# EAGLE design micro_schematic (EAGLE 9.4.0)
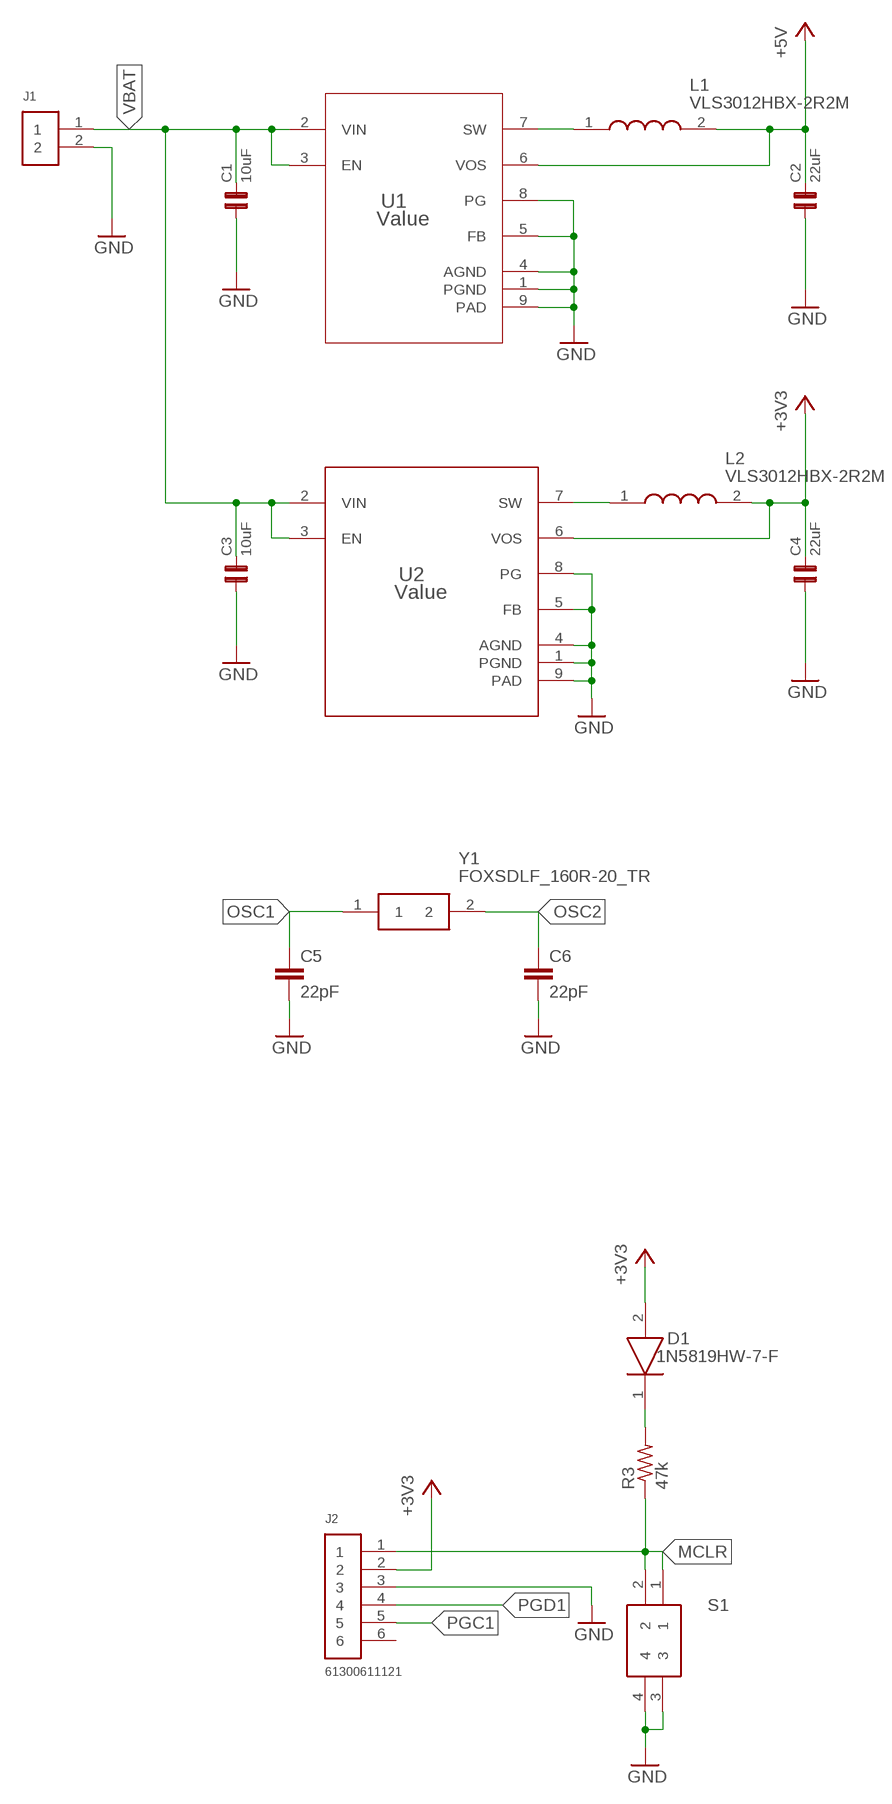
[diagram p0: schematic, sheet 1, part 1 of 2]
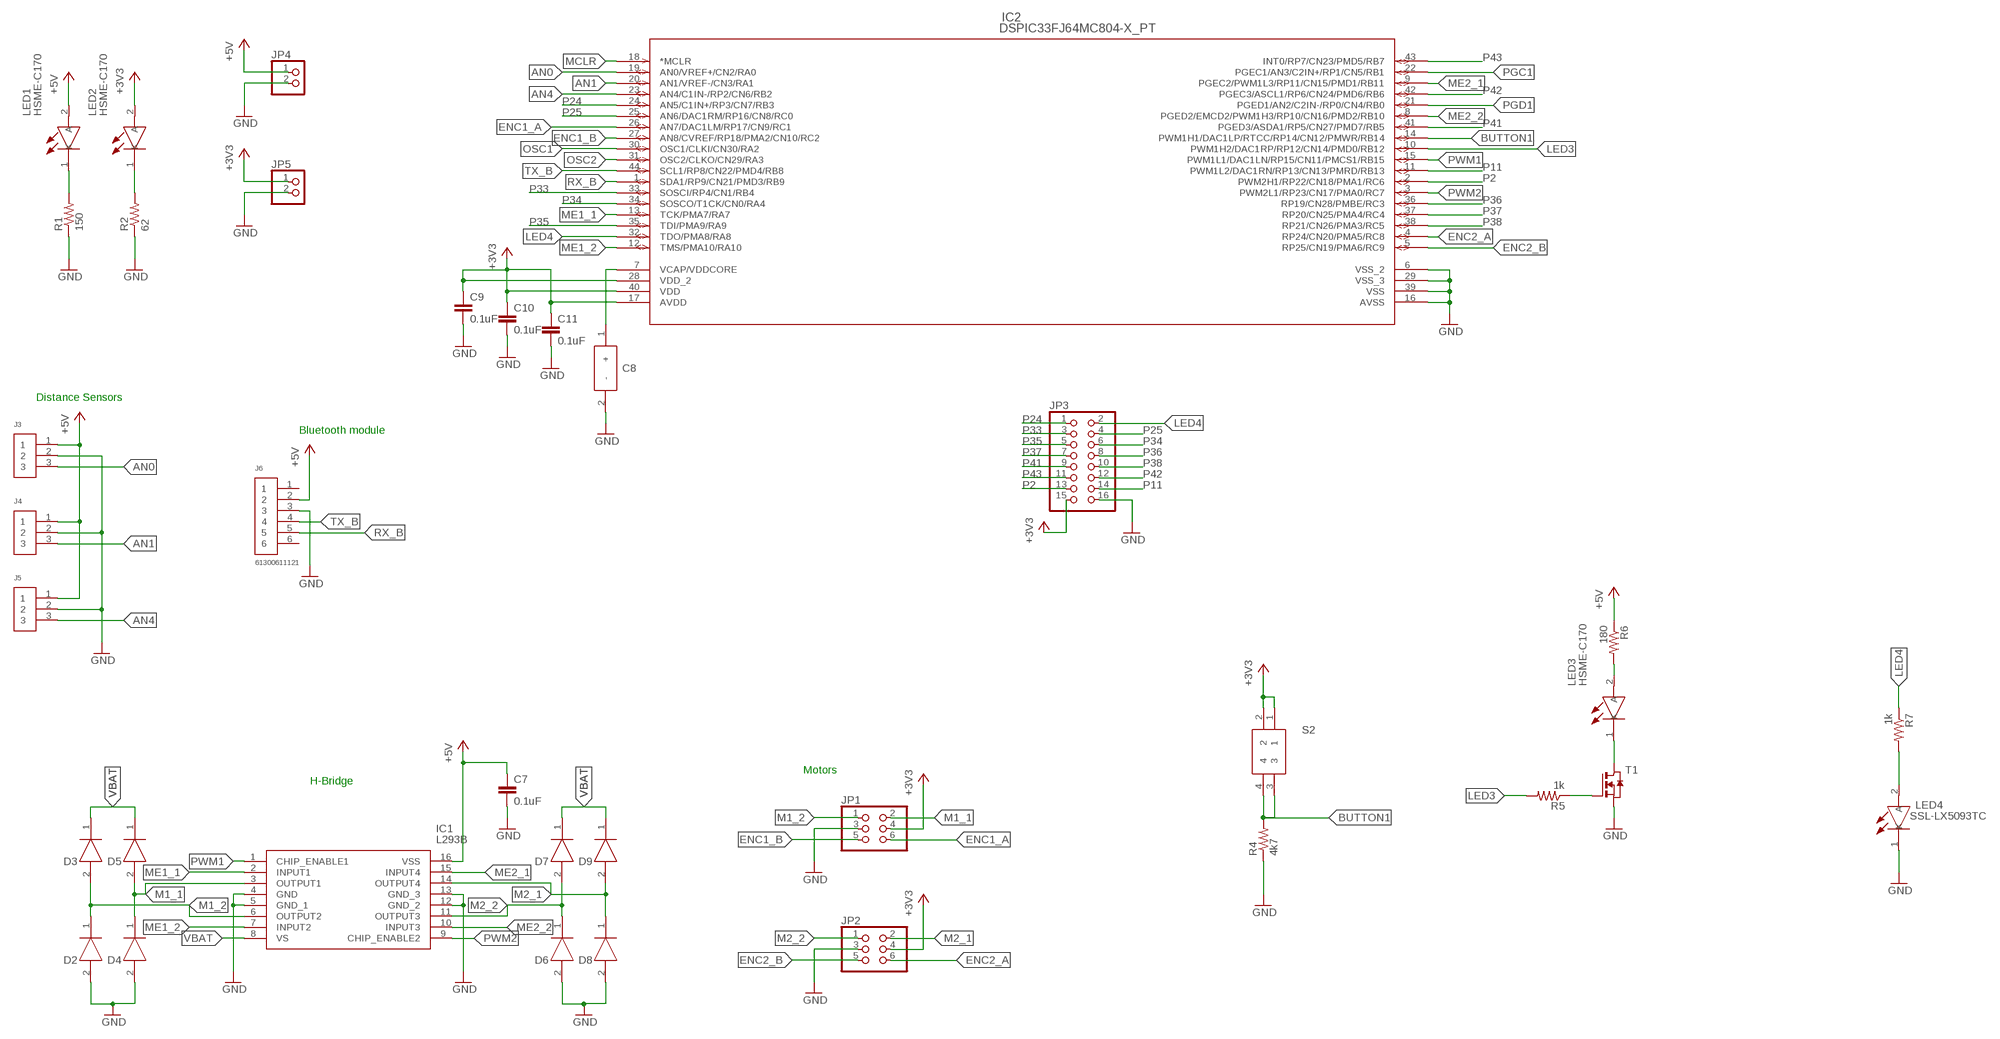
[diagram p1: schematic, sheet 1, part 2 of 2]

## Parts
C1  10uF  C0805  [0805]
C2  22uF  C0805  [0805]
C3  10uF  C0805  [0805]
C4  22uF  C0805  [0805]
C5  22pF  C-EUC0805  [C0805]
C6  22pF  C-EUC0805  [C0805]
C7  0.1uF  C-EUC0805  [C0805]
C8  TPSB106K025T1800  [DIONM3528X210N]
C9  0.1uF  C-EUC0805  [C0805]
C10  0.1uF  C-EUC0805  [C0805]
C11  0.1uF  C-EUC0805  [C0805]
D1  1N5819HW-7-F  [SOD3716X145N]
D2  1N5819HW-7-F  [SOD3716X145N]
D3  1N5819HW-7-F  [SOD3716X145N]
D4  1N5819HW-7-F  [SOD3716X145N]
D5  1N5819HW-7-F  [SOD3716X145N]
D6  1N5819HW-7-F  [SOD3716X145N]
D7  1N5819HW-7-F  [SOD3716X145N]
D8  1N5819HW-7-F  [SOD3716X145N]
D9  1N5819HW-7-F  [SOD3716X145N]
IC1  L293B  [DIP780W50P254L2000H510Q16N]
IC2  DSPIC33FJ64MC804-X_PT  [TQFP44_10X10MC]
J1  61300211121  [61300211121]
J2  61300611121  [61300611121]
J3  61300311121  [61300311121]
J4  61300311121  [61300311121]
J5  61300311121  [61300311121]
J6  61300611121  [61300611121]
JP1  PINHD-2X3  [2X03]
JP2  PINHD-2X3  [2X03]
JP3  PINHD-2X8  [2X08]
JP4  PINHD-1X2  [1X02]
JP5  PINHD-1X2  [1X02]
L1  VLS3012HBX-2R2M  [INDPM3030X120N]
L2  VLS3012HBX-2R2M  [INDPM3030X120N]
LED1  HSME-C170  [LEDC2012X90N]
LED2  HSME-C170  [LEDC2012X90N]
LED3  HSME-C170  [LEDC2012X90N]
LED4  SSL-LX5093TC  [SSL-LX5093SGC/B]
R1  150  R-US_R0805  [R0805]
R2  62  R-US_R0805  [R0805]
R3  47k  R-US_R0805  [R0805]
R4  4k7  R-US_R0805  [R0805]
R5  1k  R-US_R0805  [R0805]
R6  180  R-US_R0805  [R0805]
R7  1k  R-US_R0805  [R0805]
S1  PTS647SM50SMTR2LFS  [PTS647SM50SMTR2LFS]
S2  PTS647SM50SMTR2LFS  [PTS647SM50SMTR2LFS]
T1  NMOSSOT23  [SOT-23]
U1  Value  TPS62163DSGR  [DSG0008A]
U2  Value  TPS62162QDSGRQ1  [DSG0008A]
Y1  FOXSDLF_160R-20_TR  [FOXSDLF/240F-20]

## Nets
+3V3: C4.2 C9.1 C10.1 C11.1 D1.2(A) IC2.17(AVDD) IC2.28(VDD_2) IC2.40(VDD) J2.2 JP1.4 JP2.4 JP3.15 JP5.1 L2.2 LED2.2(A) S2.1 S2.2 U2.6(VOS)
+5V: C2.2 C7.1 IC1.16(VSS) J3.1 J4.1 J5.1 J6.2 JP4.1 L1.2 LED1.2(A) R6.1 U1.6(VOS)
AN0: IC2.19(AN0/VREF+/CN2/RA0) J3.3
AN1: IC2.20(AN1/VREF-/CN3/RA1) J4.3
AN4: IC2.23(AN4/C1IN-/RP2/CN6/RB2) J5.3
BUTTON1: IC2.14(PWM1H1/DAC1LP/RTCC/RP14/CN12/PMWR/RB14) R4.2 S2.3 S2.4
ENC1_A: IC2.26(AN7/DAC1LM/RP17/CN9/RC1) JP1.6
ENC1_B: IC2.27(AN8/CVREF/RP18/PMA2/CN10/RC2) JP1.5
ENC2_A: IC2.4(RP24/CN20/PMA5/RC8) JP2.6
ENC2_B: IC2.5(RP25/CN19/PMA6/RC9) JP2.5
GND: C1.1 C2.1 C3.1 C4.1 C5.2 C6.2 C7.2 C8.2(-) C9.2 C10.2 C11.2 D2.2(A) D4.2(A) D6.2(A) D8.2(A) IC1.4(GND) IC1.5(GND_1) IC1.12(GND_2) IC1.13(GND_3) IC2.6(VSS_2) IC2.16(AVSS) IC2.29(VSS_3) IC2.39(VSS) J1.2 J2.3 J3.2 J4.2 J5.2 J6.3 JP1.3 JP2.3 JP3.16 JP4.2 JP5.2 LED4.1(K) R1.1 R2.1 R4.1 S1.3 S1.4 T1.2(S) U1.1(PGND) U1.4(AGND) U1.5(FB) U1.8(PG) U1.9(PAD) U2.1(PGND) U2.4(AGND) U2.5(FB) U2.8(PG) U2.9(PAD)
LED3: IC2.10(PWM1H2/DAC1RP/RP12/CN14/PMD0/RB12) R5.2
LED4: IC2.32(TDO/PMA8/RA8) JP3.2 R7.1
M1_1: D4.1(K) D5.2(A) IC1.3(OUTPUT1) JP1.2
M1_2: D2.1(K) D3.2(A) IC1.6(OUTPUT2) JP1.1
M2_1: D8.1(K) D9.2(A) IC1.14(OUTPUT4) JP2.2
M2_2: D6.1(K) D7.2(A) IC1.11(OUTPUT3) JP2.1
MCLR: IC2.18(*MCLR) J2.1 R3.1 S1.1 S1.2
ME1_1: IC1.2(INPUT1) IC2.13(TCK/PMA7/RA7)
ME1_2: IC1.7(INPUT2) IC2.12(TMS/PMA10/RA10)
ME2_1: IC1.15(INPUT4) IC2.9(PGEC2/PWM1L3/RP11/CN15/PMD1/RB11)
ME2_2: IC1.10(INPUT3) IC2.8(PGED2/EMCD2/PWM1H3/RP10/CN16/PMD2/RB10)
N$1: C8.1(+) IC2.7(VCAP/VDDCORE)
N$2: LED2.1(K) R2.2
N$3: L1.1 U1.7(SW)
N$4: LED1.1(K) R1.2
N$5: L2.1 U2.7(SW)
N$6: R5.1 T1.3(G)
N$7: D1.1(K) R3.2
N$8: LED3.2(A) R6.2
N$21: LED4.2(A) R7.2
N$22: LED3.1(K) T1.1(D)
OSC1: C5.1 IC2.30(OSC1/CLKI/CN30/RA2) Y1.1
OSC2: C6.1 IC2.31(OSC2/CLKO/CN29/RA3) Y1.2
P2: IC2.2(PWM2H1/RP22/CN18/PMA1/RC6) JP3.13
P11: IC2.11(PWM1L2/DAC1RN/RP13/CN13/PMRD/RB13) JP3.14
P24: IC2.24(AN5/C1IN+/RP3/CN7/RB3) JP3.1
P25: IC2.25(AN6/DAC1RM/RP16/CN8/RC0) JP3.4
P33: IC2.33(SOSCI/RP4/CN1/RB4) JP3.3
P34: IC2.34(SOSCO/T1CK/CN0/RA4) JP3.6
P35: IC2.35(TDI/PMA9/RA9) JP3.5
P36: IC2.36(RP19/CN28/PMBE/RC3) JP3.8
P37: IC2.37(RP20/CN25/PMA4/RC4) JP3.7
P38: IC2.38(RP21/CN26/PMA3/RC5) JP3.10
P41: IC2.41(PGED3/ASDA1/RP5/CN27/PMD7/RB5) JP3.9
P42: IC2.42(PGEC3/ASCL1/RP6/CN24/PMD6/RB6) JP3.12
P43: IC2.43(INT0/RP7/CN23/PMD5/RB7) JP3.11
PGC1: IC2.22(PGEC1/AN3/C2IN+/RP1/CN5/RB1) J2.5
PGD1: IC2.21(PGED1/AN2/C2IN-/RP0/CN4/RB0) J2.4
PWM1: IC1.1(CHIP_ENABLE1) IC2.15(PWM1L1/DAC1LN/RP15/CN11/PMCS1/RB15)
PWM2: IC1.9(CHIP_ENABLE2) IC2.3(PWM2L1/RP23/CN17/PMA0/RC7)
RX_B: IC2.1(SDA1/RP9/CN21/PMD3/RB9) J6.5
TX_B: IC2.44(SCL1/RP8/CN22/PMD4/RB8) J6.4
VBAT: C1.2 C3.2 D3.1(K) D5.1(K) D7.1(K) D9.1(K) IC1.8(VS) J1.1 U1.2(VIN) U1.3(EN) U2.2(VIN) U2.3(EN)
Unconnected: J2.6 J6.1 J6.6

## Notes on the sheet
- Distance Sensors
- Bluetooth module
- Motors
- H-Bridge

## Library data of the parts
C1-C4 = capsmd:C0805
C5-C7 C9-C11 = rcl-2:C-EU: CAPACITOR, European symbol
C8 = SamacSys_Parts:TPSB106K025T1800: Tantalum Capacitors - Solid SMD 25V 10uF 10% ESR=1800Ohm AEC-Q200 Source: Datasheet <https://componentsearchengine.com/Datasheets/1/TPSB106K025T1800.pdf>; DESCRIPTION: Tantalum Capacitors - Solid SMD 25V 10uF 10% ESR=1800Ohm AEC-Q200; HEIGHT: 2.1mm; MANUFACTURER_NAME: AVX; MANUFACTURER_PART_NUMBER: TPSB106K025T1800; MOUSER_PART_NUMBER: 581-TPSB106K025T1800; MOUSER_PRICE-STOCK: https://www.mouser.com/Search/Refine.aspx?Keyword=581-TPSB106K025T1800
D1-D9 = SamacSys_Parts:1N5819HW-7-F: Diode Schottky 1A 40V SOD123 Diodes Inc 1N5819HW-7-F, SMT Schottky Diode, 40V 1A, 2-Pin SOD-123 Source: Datasheet <https://componentsearchengine.com/Datasheets/1/1N5819HW-7-F.pdf>; DESCRIPTION: Diode Schottky 1A 40V SOD123 Diodes Inc 1N5819HW-7-F, SMT Schottky Diode, 40V 1A, 2-Pin SOD-123; HEIGHT: 1.45mm; MANUFACTURER_NAME: Diodes Inc.; MANUFACTURER_PART_NUMBER: 1N5819HW-7-F; MOUSER_PART_NUMBER: 621-1N5819HW-F; MOUSER_PRICE-STOCK: https://www.mouser.com/Search/Refine.aspx?Keyword=621-1N5819HW-F
IC1 = SamacSys_Parts:L293B: L293B, Motor Driver, 4.5 36 V, 16-Pin PDIP Source: Datasheet <https://componentsearchengine.com/Datasheets/1/L293B.pdf>; DESCRIPTION: L293B, Motor Driver, 4.5 36 V, 16-Pin PDIP; HEIGHT: 5.1mm; MANUFACTURER_NAME: STMicroelectronics; MANUFACTURER_PART_NUMBER: L293B; MOUSER_PART_NUMBER: 511-L293B; MOUSER_PRICE-STOCK: https://www.mouser.com/Search/Refine.aspx?Keyword=511-L293B
IC2 = dspic33fj64mc804:DSPIC33FJ64MC804-X_PT
J1 = Headers:61300211121: CONN HEADER VERT 2POS 2.54MM Manufacturer's datasheet <https://katalog.we-online.de/em/datasheet/6130xx11121.pdf>; CREATED_BY: PCBLayout.com; DIGI_KEY_PART_NUMBER: 732-5315-ND; MANUFACTURER: Wurth Electronics Inc.; MPN: 61300211121
J2 J6 = Headers:61300611121: CONN HEADER VERT 6POS 2.54MM Manufacturer's datasheet <https://katalog.we-online.de/em/datasheet/6130xx11121.pdf>; CREATED_BY: PCBLayout.com; DIGI_KEY_PART_NUMBER: 732-5319-ND; MANUFACTURER: Wurth Electronics Inc.; MPN: 61300611121
J3-J5 = Headers:61300311121: CONN HEADER VERT 3POS 2.54MM Manufacturer's datasheet <https://katalog.we-online.de/em/datasheet/6130xx11121.pdf>; CREATED_BY: PCBLayout.com; DIGI_KEY_PART_NUMBER: 732-5316-ND; MANUFACTURER: Wurth Electronics Inc.; MPN: 61300311121
JP1 JP2 = pinhead:PINHD-2X3: PIN HEADER
JP3 = pinhead:PINHD-2X8: PIN HEADER
JP4 JP5 = pinhead:PINHD-1X2: PIN HEADER
L1 L2 = SamacSys_Parts:VLS3012HBX-2R2M: Fixed Inductors 3x3x1.2mm 2.2uH 20% Magnetic Pwr Inductr Source: Datasheet <https://componentsearchengine.com/Datasheets/1/VLS3012HBX-2R2M.pdf>; DESCRIPTION: Fixed Inductors 3x3x1.2mm 2.2uH 20% Magnetic Pwr Inductr; HEIGHT: 1.2mm; MANUFACTURER_NAME: TDK; MANUFACTURER_PART_NUMBER: VLS3012HBX-2R2M; MOUSER_PART_NUMBER: 810-VLS3012HBX-2R2M; MOUSER_PRICE-STOCK: https://www.mouser.com/Search/Refine.aspx?Keyword=810-VLS3012HBX-2R2M
LED1-LED3 = SamacSys_Parts:HSME-C170: BROADCOM LIMITED - HSME-C170 - LED, SMD, GREEN Source: Datasheet; DESCRIPTION: BROADCOM LIMITED - HSME-C170 - LED, SMD, GREEN; HEIGHT: 0.9mm; MANUFACTURER_NAME: Avago Technologies; MANUFACTURER_PART_NUMBER: HSME-C170; MOUSER_PART_NUMBER: 630-HSME-C170; MOUSER_PRICE-STOCK: https://www.mouser.com/Search/Refine.aspx?Keyword=630-HSME-C170
LED4 = SSL-LX5093TC:SSL-LX5093TC: Lumex SSL-LX5093TC Turquoise LED, 5mm (T-1 3/4) Clear, Dome Lens Through Hole Package Source: Datasheet <https://componentsearchengine.com/Datasheets/1/SSL-LX5093TC.pdf>; DESCRIPTION: Lumex SSL-LX5093TC Turquoise LED, 5mm (T-1 3/4) Clear, Dome Lens Through Hole Package; HEIGHT: mm; MANUFACTURER_NAME: Lumex; MANUFACTURER_PART_NUMBER: SSL-LX5093TC; MOUSER_PART_NUMBER: 696-SSL-LX5093TC; MOUSER_PRICE-STOCK: https://www.mouser.com/Search/Refine.aspx?Keyword=696-SSL-LX5093TC
R1-R7 = rcl:R-US_: RESISTOR, American symbol; SPICEPREFIX: R
S1 S2 = SamacSys_Parts:PTS647SM50SMTR2LFS: Tactile Switches 50mA 12VDC, 1.8N 5.0mm H, G leads Source: Datasheet <https://www.ckswitches.com/media/2567/pts647.pdf>; DESCRIPTION: Tactile Switches 50mA 12VDC, 1.8N 5.0mm H, G leads; HEIGHT: 5.25mm; MANUFACTURER_NAME: C & K COMPONENTS; MANUFACTURER_PART_NUMBER: PTS647SM50SMTR2LFS; MOUSER_PART_NUMBER: 611-PTS647SM50SMTR2L; MOUSER_PRICE-STOCK: https://www.mouser.com/Search/Refine.aspx?Keyword=611-PTS647SM50SMTR2L
T1 = zetex:NMOSSOT23: MOS FET; OC_FARNELL: unknown; OC_NEWARK: unknown
U1 = tps62163:TPS62163DSGR; ALTERNATEPARTNUMBER: TPS62163DSGT; APPLICATION_BUILDNUMBER: *; COMPTYPE: IC; MANUFACTURER: Texas Instruments; MOUNTTYPE: SMT; PACKAGEREFERENCE: DSG0008A; PARTNUMBER: TPS62163DSGR; PIN_COUNT: 9; REFDES: RefDes; ROHS: Y; SPICEPREFIX: X; TYPE: TYPE
U2 = tps62162:TPS62162QDSGRQ1; MANUFACTURER: Texas Instruments; PARTNUMBER: TPS62162QDSGRQ1; REFDES: RefDes; TYPE: TYPE
Y1 = SamacSys_Parts:FOXSDLF_160R-20_TR: Crystals 16MHz 20pF '-40C +85C Source: Datasheet <https://componentsearchengine.com/Datasheets/1/FOXSDLF_160R-20_TR.pdf>; DESCRIPTION: Crystals 16MHz 20pF '-40C +85C; HEIGHT: mm; MANUFACTURER_NAME: Fox; MANUFACTURER_PART_NUMBER: FOXSDLF/160R-20/TR; MOUSER_PART_NUMBER: 559-FOXSDLF/160R-20; MOUSER_PRICE-STOCK: https://www.mouser.com/Search/Refine.aspx?Keyword=559-FOXSDLF%2F160R-20

## Board
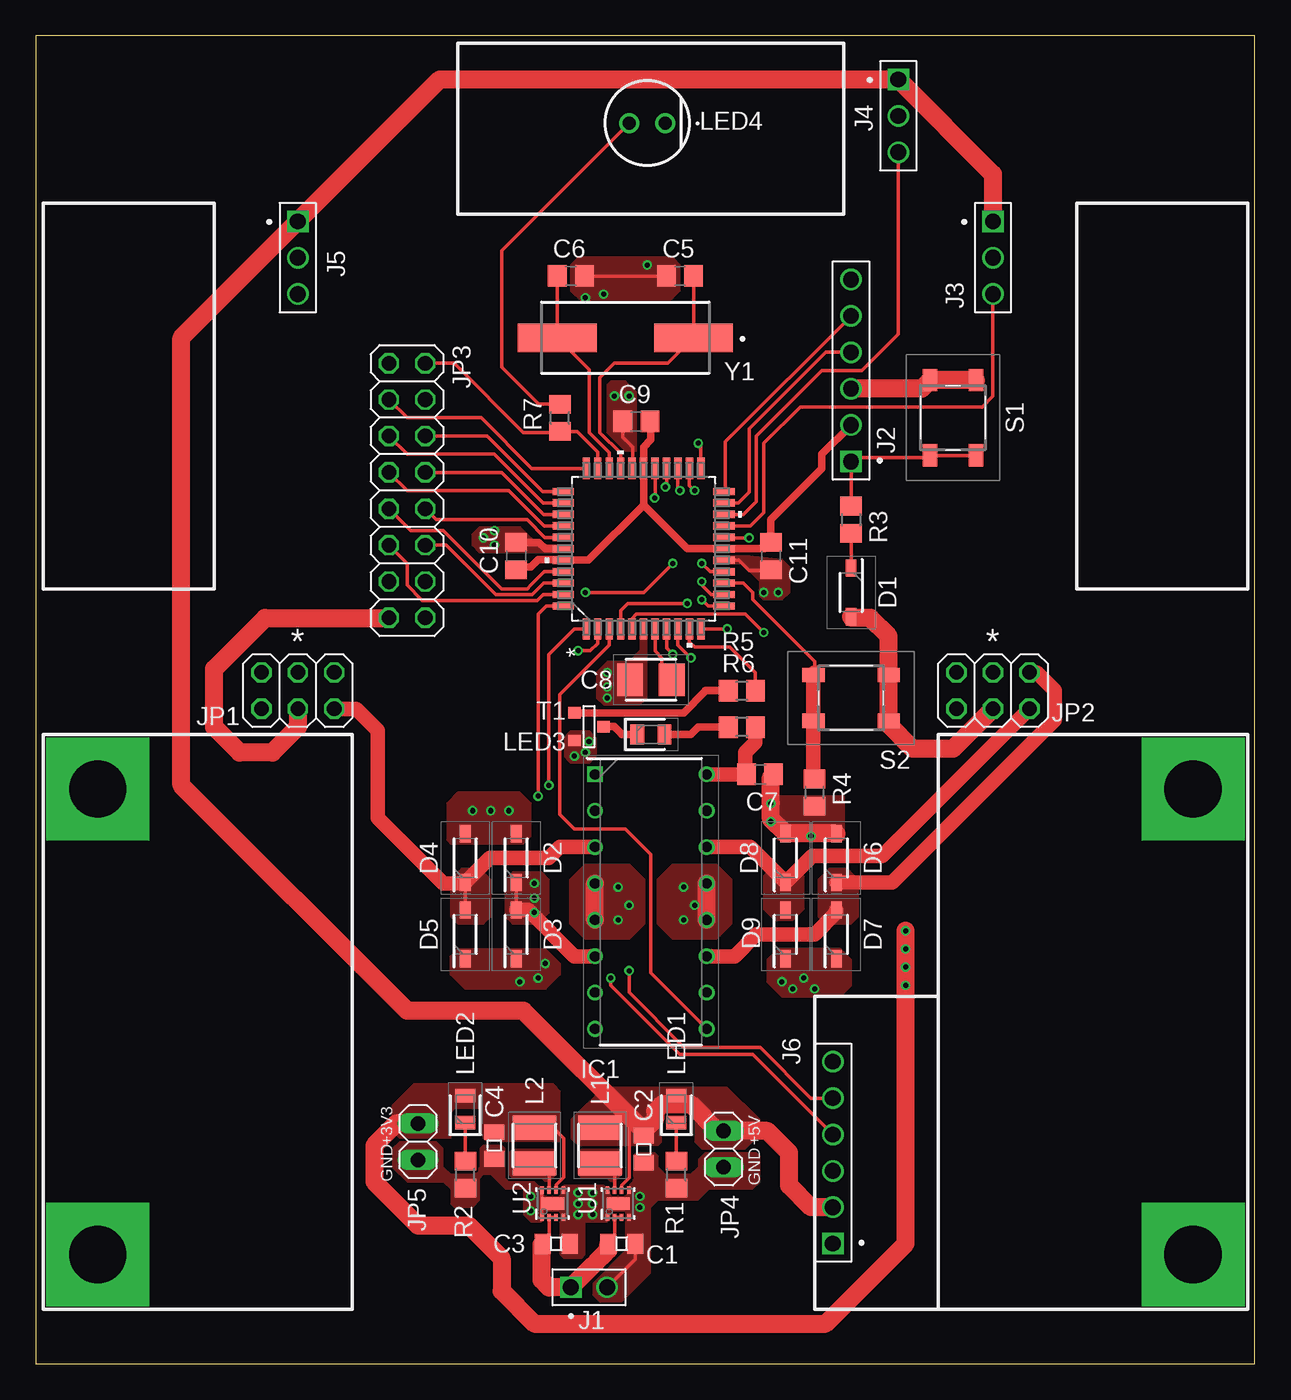
[diagram p2: board, top side]
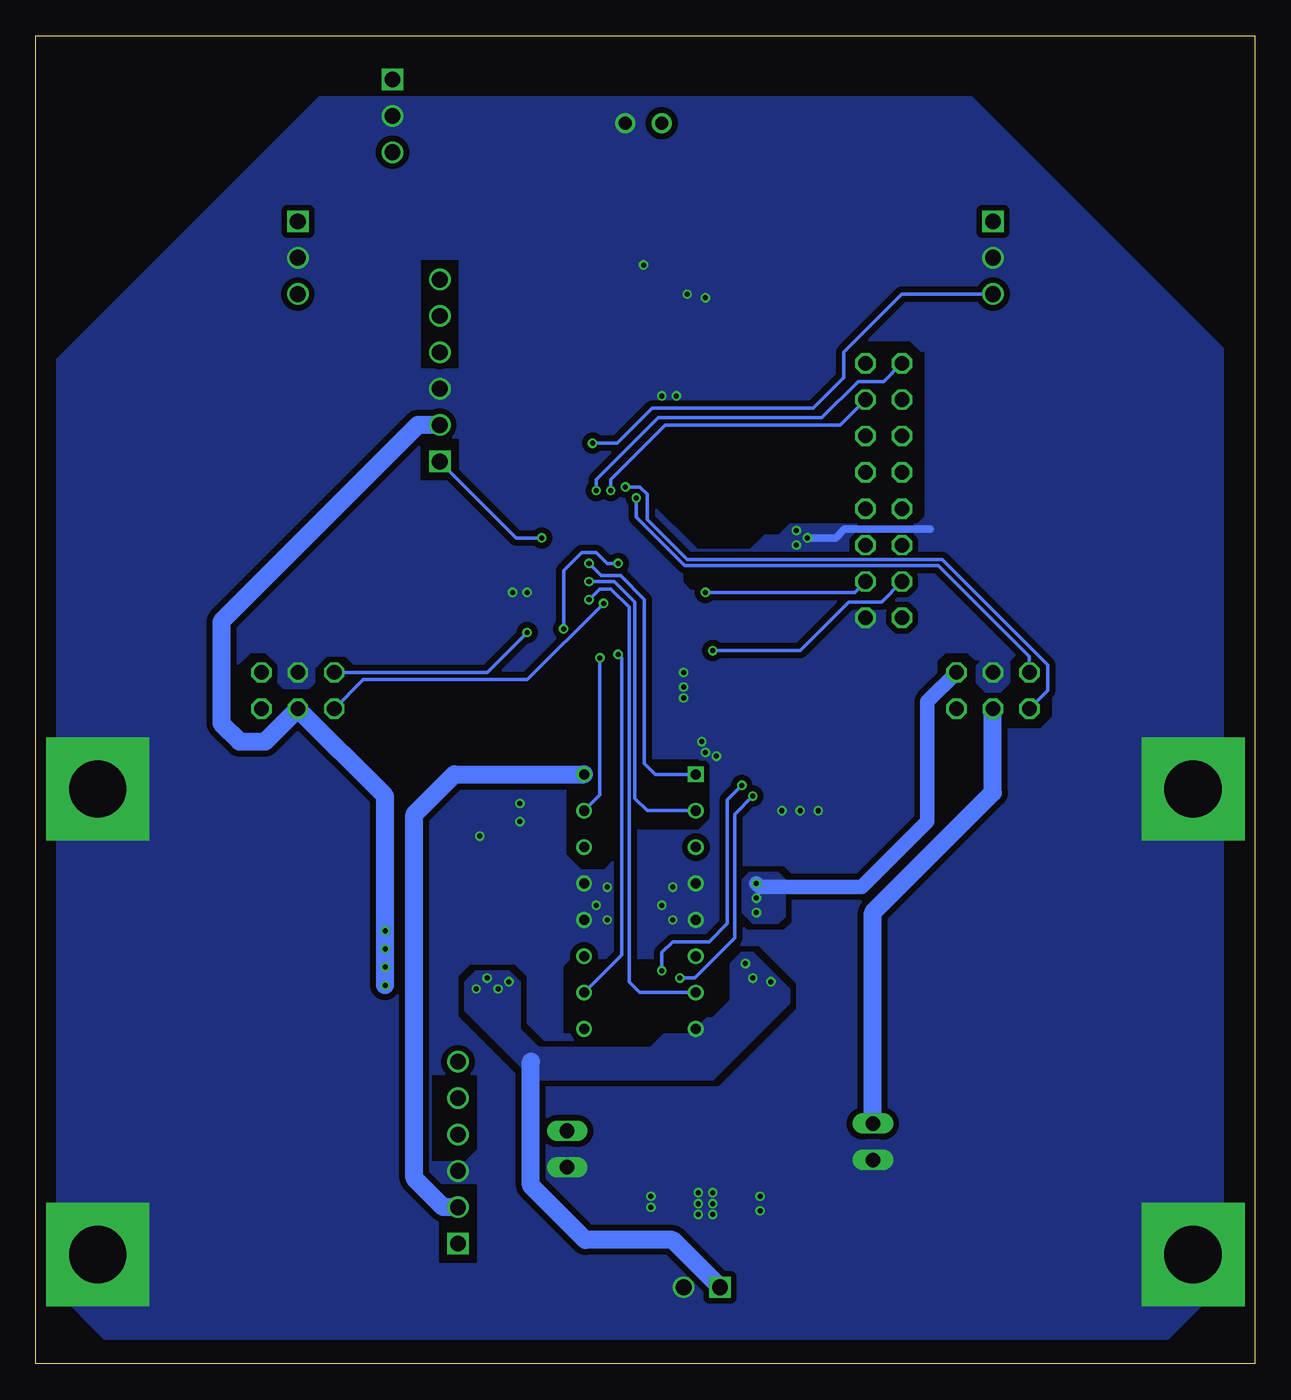
[diagram p3: board, bottom side, seen from below]

Size 85.09 x 92.71 mm. Coordinates in mm from the lower left corner, seen from the top.
Outline: 0,0 85.09,0 85.09,92.71 0,92.71 0,81.53 0,0
Copper layers (1*16): Top 0.035mm / dielectric 1.5mm / Bottom 0.035mm
Design rules "PCB-POOL Standard": minimum track width 0.15mm, minimum drill 0.3mm, track to track 0.15mm, track to pad 0.15mm, pad to pad 0.15mm, via to via 0.15mm, smd to smd 0.15mm, copper to edge 0.3mm, drill to drill 0.2mm, minimum pad ring 0.2mm, minimum via ring 0.15mm, stop-mask expansion 0.03mm, vias tented up to drill 0mil, thermal gap 0.2mm

### Footprints (pad centres in the part's own frame; a part is rotated, then mirrored left to right if it is on the bottom)
0805 = smd 1.092 x 1.397: 1 -0.94,0; 2 0.94,0
C0805 = smd 1.3 x 1.5: 1 -0.95,0; 2 0.95,0
DIONM3528X210N = smd 1.8 x 2.3: 1 -1.45,0; 2 1.45,0
SOD3716X145N = smd 1.2 x 0.75: 1 -1.7,0; 2 1.7,0
DIP780W50P254L2000H510Q16N = drill 0.7 pad 1.1 square: 1 -3.9,8.89 | drill 0.7 pad 1.1: 2 -3.9,6.35; 3 -3.9,3.81; 4 -3.9,1.27; 5 -3.9,-1.27; 6 -3.9,-3.81; 7 -3.9,-6.35; 8 -3.9,-8.89; 9 3.9,-8.89; 10 3.9,-6.35; 11 3.9,-3.81; 12 3.9,-1.27; 13 3.9,1.27; 14 3.9,3.81; 15 3.9,6.35; 16 3.9,8.89
TQFP44_10X10MC = smd 1.473 x 0.508: 1 -5.613,4; 2 -5.613,3.2; 3 -5.613,2.4; 4 -5.613,1.6; 5 -5.613,0.8; 6 -5.613,0; 7 -5.613,-0.8; 8 -5.613,-1.6; 9 -5.613,-2.4; 10 -5.613,-3.2; 11 -5.613,-4; 23 5.613,-4; 24 5.613,-3.2; 25 5.613,-2.4; 26 5.613,-1.6; 27 5.613,-0.8; 28 5.613,0; 29 5.613,0.8; 30 5.613,1.6; 31 5.613,2.4; 32 5.613,3.2; 33 5.613,4 | smd 0.508 x 1.473: 12 -4,-5.613; 13 -3.2,-5.613; 14 -2.4,-5.613; 15 -1.6,-5.613; 16 -0.8,-5.613; 17 0,-5.613; 18 0.8,-5.613; 19 1.6,-5.613; 20 2.4,-5.613; 21 3.2,-5.613; 22 4,-5.613; 34 4,5.613; 35 3.2,5.613; 36 2.4,5.613; 37 1.6,5.613; 38 0.8,5.613; 39 0,5.613; 40 -0.8,5.613; 41 -1.6,5.613; 42 -2.4,5.613; 43 -3.2,5.613; 44 -4,5.613
61300211121 = drill 1.1 square: 1 -1.27,0 | drill 1.1: 2 1.27,0
61300611121 = drill 1.1 square: 1 -6.35,0 | drill 1.1: 2 -3.81,0; 3 -1.27,0; 4 1.27,0; 5 3.81,0; 6 6.35,0
61300311121 = drill 1.1 square: 1 -2.54,0 | drill 1.1: 2 0,0; 3 2.54,0
2X03 = drill 1.016 octagon: 1 -2.54,-1.27; 2 -2.54,1.27; 3 0,-1.27; 4 0,1.27; 5 2.54,-1.27; 6 2.54,1.27
2X08 = drill 1.016 octagon: 1 -8.89,-1.27; 2 -8.89,1.27; 3 -6.35,-1.27; 4 -6.35,1.27; 5 -3.81,-1.27; 6 -3.81,1.27; 7 -1.27,-1.27; 8 -1.27,1.27; 9 1.27,-1.27; 10 1.27,1.27; 11 3.81,-1.27; 12 3.81,1.27; 13 6.35,-1.27; 14 6.35,1.27; 15 8.89,-1.27; 16 8.89,1.27
1X02 = drill 1.016 long: 1 -1.27,0; 2 1.27,0
INDPM3030X120N = smd 1.7 x 3.05: 1 -1.25,0; 2 1.25,0
LEDC2012X90N = smd 0.95 x 1.4: 1 -0.95,0; 2 0.95,0
SSL-LX5093SGC/B = drill 0.91 pad 1.4: 1 1.27,0; 2 -1.27,0
R0805 = smd 1.3 x 1.5: 1 -0.95,0; 2 0.95,0
PTS647SM50SMTR2LFS = smd 1.55 x 1: 1 -2.625,1.6; 2 -2.625,-1.6; 3 2.625,-1.6; 4 2.625,1.6
SOT-23 = smd 0.787 x 0.889: 1 0.025,-1.016; 2 -0.94,1.016; 3 0.991,1.016
DSG0008A = smd 0.5 x 0.25: 1 -0.95,0.75; 2 -0.95,0.25; 3 -0.95,-0.25; 4 -0.95,-0.75; 5 0.95,-0.75; 6 0.95,-0.25; 7 0.95,0.25; 8 0.95,0.75 | smd 0.9 x 1.6: 9 0,0
FOXSDLF/240F-20 = smd 5.5 x 2: 1 -4.75,0; 2 4.75,0

### Placement (x,y rotation side)
C1  40.89,8.38 180 top
C2  42.42,14.99 90 top
C3  36.32,8.38 180 top
C4  32,15.24 90 top
C5  44.96,75.95 180 top
C6  37.34,75.95 0 top
C7  50.55,41.15 0 top
C8  42.93,47.75 180 top
C9  41.91,65.79 180 top
C10  33.53,56.39 90 top
C11  51.31,56.39 270 top
D1  56.9,53.85 270 top
D2  33.53,35.31 90 top
D3  33.53,29.97 90 top
D4  29.97,35.31 90 top
D5  29.97,29.97 90 top
D6  55.88,35.31 90 top
D7  55.88,29.97 90 top
D8  52.32,35.31 90 top
D9  52.32,29.97 90 top
IC1  42.93,32.26 0 top
IC2  42.42,56.9 90 top
J1  38.61,5.33 0 top
J2  56.9,69.34 90 top
J3  66.8,77.22 270 top
J4  60.2,87.12 270 top
J5  18.29,77.22 270 top
J6  55.63,14.73 90 top
JP1  18.29,46.99 180 top
JP2  66.8,46.99 180 top
JP3  25.91,60.96 270 top
JP4  48.01,14.99 270 top
JP5  26.67,15.49 270 top
L1  39.37,15.24 90 top
L2  34.8,15.24 90 top
LED1  44.7,17.78 90 top
LED2  29.97,17.78 90 top
LED3  42.93,43.94 0 top
LED4  42.67,86.61 0 top
R1  44.7,13.21 90 top
R2  29.97,13.21 90 top
R3  56.9,58.93 270 top
R4  54.36,39.88 90 top
R5  49.28,46.99 0 top
R6  49.28,44.45 180 top
R7  36.58,66.04 90 top
S1  64.01,66.04 90 top
S2  56.9,46.48 180 top
T1  38.61,44.45 90 top
U1  40.64,11.18 90 top
U2  36.07,11.18 90 top
Y1  41.15,71.63 180 top

### Tracks (layer width: path | path; a pad name or v marks a point on that pad's centre or on a via)
+3V3  (via drill 0.35)
  Top 0.254: 35.81,16.76 36.83,15.75 36.83,13 36.32,12.49 U2.6 | 36.32,56.13 36.77,56.13 IC2.40
  Top 0.508: IC2.40 38.57,56.1 42.42,59.94 | 42.42,59.94 IC2.28 42.42,64.01 42.93,64.52 42.93,65.72 C9.1 | C10.1 33.72,55.63 34.54,55.63 35.05,56.13 36.32,56.13 | 42.42,59.94 45.47,56.9 IC2.17 50.87,56.9 C11.1 51.31,58.93 54.86,62.48 54.86,63.5 J2.2
  Top 1.27: JP5.1 25.15,16.76 23.62,15.24 23.62,12.7 26.67,9.65 30.23,9.65 32.51,7.37 32.51,5.08 34.8,2.79 55.12,2.79 60.71,8.38 v60.71,26.42 v60.71,27.69 v60.71,28.96 v60.71,30.23 | JP2.4 64.01,42.93 61.21,42.93 59.52,44.62 S2.1 S2.2 59.52,50.8 58.25,52.07 56.97,52.07 D1.2 | JP1.4 18.29,44.45 16.51,42.67 14.22,42.67 12.45,44.45 12.45,48.51 16,52.07 JP3.15
  Bottom 1.27: JP5.1 26.67,31.5 18.29,39.88 JP1.4 | v60.71,26.42 60.71,39.62 JP2.4 69.09,43.43 70.87,43.43 72.14,44.7 72.14,51.82 58.42,65.53 J2.2
  pour Top (no thermals): 36.58,15.49 31.5,15.49 31.24,15.75 31.24,17.78 29.21,17.78 28.96,17.53 28.96,15.75 25.4,15.75 24.89,16.26 24.89,18.03 26.42,19.56 36.07,19.56 36.58,19.05
+5V
  Top 0.254: U1.6 40.89,12.45 41.43,12.98 41.43,16.74
  Top 1.016: IC1.16 C7.1 49.53,41.21 49.53,42.67 50.23,43.37 R6.1
  Top 1.27: J6.2 54.1,10.92 52.58,12.45 52.58,14.73 51.05,16.26 JP4.1 47.56,16.26 45.73,18.09 43.68,18.09 43.22,17.63 43.22,17.06 42.42,16.26 34.04,24.64 25.91,24.64 10.16,40.39 10.16,71.63 J5.1 28.19,89.66 J4.1 66.8,83.06 J3.1
  Bottom 1.27: J6.2 56.64,10.92 58.67,12.95 58.67,38.35 55.88,41.15 IC1.16
  pour Top (no thermals): 37.34,15.75 37.85,15.24 43.43,15.24 43.69,15.49 43.69,17.53 45.97,17.53 45.97,15.49 46.48,14.99 49.53,14.99 50.55,16 50.55,17.02 48.26,19.3 39.62,19.3 37.34,17.02
AN0
  Top 0.254: IC2.19 49.86,58.5 50.8,59.44 50.8,64.26 53.34,66.8 66.04,66.8 66.8,67.56 J3.3
AN1
  Top 0.254: J4.3 60.2,71.88 57.65,69.33 54.85,69.33 50.29,64.77 50.29,60.2 49.39,59.3 IC2.20
AN4  (via drill 0.35)
  Top 0.254: IC2.23 46.42,64.07 v46.23,64.26
  Bottom 0.254: v46.23,64.26 44.51,64.26 42.07,66.71 30.83,66.71 28.7,68.83 28.7,70.61 24.64,74.68 J5.3
BUTTON1
  Top 0.254: 54.27,40.91 R4.2 | IC2.14 49.39,54.5 50.04,53.85 50.04,53.34 54.36,49.02 54.36,48.26 54.36,48
  Top 0.508: S2.3 54.36,48
  Top 1.016: 54.36,48.26 54.27,48.17 S2.4 54.27,40.91
ENC1_A  (via drill 0.35)
  Top 0.254: v43.94,61.21 44.02,61.29 IC2.26
  Bottom 0.254: v43.94,61.21 42.93,61.21 42.42,60.71 42.42,58.93 39.62,56.13 21.84,56.13 14.48,48.77 14.48,46.99 JP1.6
ENC1_B  (via drill 0.35)
  Top 0.254: IC2.27 43.22,60.49 v43.18,60.45
  Bottom 0.254: v43.18,60.45 43.18,59.12 39.79,55.73 22.1,55.73 15.75,49.38 JP1.5
ENC2_A  (via drill 0.35)
  Top 0.254: IC2.4 40.82,52.58 41.33,53.09 v45.47,53.09
  Bottom 0.254: v45.47,53.09 50.8,47.75 62.23,47.75 JP2.6
ENC2_B  (via drill 0.35)
  Top 0.254: v50.8,51.05 49.53,52.32 41.91,52.32 41.62,52.03 IC2.5
  Bottom 0.254: v50.8,51.05 53.59,48.26 JP2.5
GND  (via drill 0.35, 4)
  Top 0.254: J1.2 41.83,7.29 C1.1 | U2.1 U2.8 | C9.2 40.96,64.7 41.66,64.01 41.66,62.55 IC2.29 | IC2.16 49.06,56.1 49.78,55.37 51.24,55.37 C11.2 | C6.2 C5.2
  Top 0.508: IC2.39 35.56,56.9 35.12,57.34 C10.2
  Top 1.27: S1.3 S1.4 61.81,68.07 J2.3 | D6.2 D8.2 51.31,38.02 v51.31,39.12 51.31,40.96 C7.2 | IC1.5 IC1.4 | IC1.12 IC1.13
  Bottom 0.508: v31.24,57.66 29.26,57.66 28.66,58.26 22.65,58.26
  other vias: 40.64,33.27 41.4,32 40.64,30.99 45.21,33.27 45.97,32 45.21,30.99 51.31,37.85 54.1,36.83 51.82,53.85 50.8,53.85 32,57.15 32,58.17 41.4,67.56 40.39,67.56 38.35,74.42 39.62,74.68 42.67,76.71 33.02,38.61 31.75,38.61 30.48,38.61 4.32,40.13 4.32,7.62 80.77,40.13 80.77,7.62 37.85,11.94 38.86,11.94 38.86,11.18 37.85,11.18 38.86,10.41 37.85,10.41 34.54,10.67 34.54,11.68 42.16,11.68 42.16,10.92 39.88,48.26 39.88,47.24 39.88,46.48 37.59,42.42 38.35,42.67 38.61,43.43
  pour Top (no thermals): 28.45,14.99 27.94,15.49 25.4,15.49 24.89,14.99 24.89,13.72 25.91,12.7 28.45,12.7 28.96,12.19 28.96,11.18 29.21,10.92 30.48,10.92 30.99,11.43 30.99,12.95 31.24,13.21 31.75,13.21 32.77,12.19 34.04,12.19 34.04,10.41 34.54,9.91 35.31,9.91 35.56,10.16 35.56,10.41 36.58,10.41 36.58,7.62 36.83,7.37 38.1,7.37 38.35,7.62 38.35,9.91 39.88,9.91 40.13,10.16 40.13,10.41 40.39,10.67 41.15,10.67 41.15,7.87 38.86,5.59 38.86,4.83 39.37,4.32 40.89,4.32 42.93,6.35 42.93,10.92 43.43,11.43 46.23,11.43 46.99,12.19 50.04,12.19 50.55,12.7 50.55,14.48 50.29,14.73 46.74,14.73 46.23,14.22 46.23,13.72 45.72,13.21 43.94,13.21 43.43,13.72 43.43,14.48 43.18,14.73 41.91,14.73 41.66,14.48 41.66,12.7 41.4,12.45 41.4,11.94 41.15,11.68 40.13,11.68 40.13,11.94 39.62,12.45 36.83,12.45 36.58,12.19 36.58,11.94 36.32,11.68 35.56,11.68 35.31,11.94 35.31,12.19 34.8,12.7 33.02,12.7 32.77,12.95 32.77,14.99 32.51,15.24 31.24,15.24 30.99,14.99 30.99,13.72 30.48,13.21 28.96,13.21 28.45,13.72
  pour Top (no thermals): 37.34,33.78 38.35,34.8 41.4,34.8 42.42,33.78 42.42,30.73 41.4,29.72 38.35,29.72 37.34,30.73
  pour Top (no thermals): 43.43,33.78 44.45,34.8 47.5,34.8 48.51,33.78 48.51,30.73 47.5,29.72 44.45,29.72 43.43,30.73
  pour Top (no thermals): 47.75,56.39 49.78,56.39 52.07,56.13 52.58,55.63 52.58,53.85 52.07,53.34 50.8,53.34 50.55,53.59 50.55,54.61 49.28,55.88 47.75,55.88
  pour Top (no thermals): 41.91,63.75 41.91,67.82 41.15,68.58 40.13,68.58 39.88,68.33 39.88,65.02 41.15,63.75
  pour Top (no thermals): 44.2,74.17 44.96,74.93 44.96,76.71 44.45,77.22 37.85,77.22 37.34,76.71 37.34,74.93 38.1,74.17
  pour Top (no thermals): 28.7,36.58 28.96,36.32 34.04,36.32 34.54,36.83 34.54,39.12 33.78,39.88 29.46,39.88 28.7,39.12
  pour Top (no thermals): 56.39,39.62 56.39,36.58 51.82,36.58 51.82,39.62
  pour Top (no thermals): 37.34,57.15 37.34,56.64 31.5,56.64 30.99,56.64 30.48,57.15 30.48,57.91 30.99,58.42 32.77,58.42 33.78,58.42 34.04,58.17 35.05,57.15
  pour Bottom (isolate 0.406, rank 2, no thermals): 19.81,88.39 65.28,88.39 83.57,70.1 83.57,5.08 80.26,1.78 6.1,1.78 2.29,5.59 2.29,70.87
  cutout Bottom: 55.63,76.96 58.17,76.96 58.17,69.6 55.63,69.6
  cutout Bottom: 58.17,61.72 58.17,64.52 55.63,64.52 55.63,61.98 55.88,61.72
  cutout Bottom: 62.99,48.77 63.5,49.28 64.77,49.28 65.53,48.51 65.53,48.26 65.53,47.5 66.04,46.99 67.82,46.99 68.33,47.5 68.33,48.77 69.09,49.53 69.34,49.53 70.1,49.53 71.12,48.51 71.12,44.96 70.61,44.45 63.5,44.45 62.99,44.96
  cutout Bottom: 14.22,48.51 15.24,49.53 16.51,49.53 17.02,49.02 17.02,48.51 17.02,47.5 17.78,46.74 18.8,46.74 19.56,47.5 19.56,47.75 19.56,48.77 19.3,49.02 19.56,49.02 20.07,49.53 21.59,49.53 22.1,49.02 22.1,44.96 21.84,44.7 21.59,44.45 14.99,44.45 14.22,45.21
  cutout Bottom: 54.36,20.07 57.4,20.07 57.4,14.22 55.12,14.22 54.36,14.99
  cutout Bottom: 54.36,12.45 56.9,12.45 56.9,7.11 54.36,7.11
  pour Top (no thermals): 42.16,50.8 42.16,49.78 41.4,49.02 39.88,49.02 39.12,48.26 39.12,46.48 39.62,45.97 42.16,45.97 42.67,46.48 42.67,50.8
  pour Top (no thermals): 36.83,43.69 37.34,44.2 37.59,44.2 38.61,44.2 38.86,43.94 39.12,43.69 39.12,42.67 39.12,42.42 38.86,42.16 38.61,41.91 37.59,41.91 37.34,41.91 36.83,42.42
  cutout Bottom: 48.26,40.39 44.7,40.39 44.7,35.31 45.47,34.54 46.99,34.54 48.01,35.56 48.01,40.39
  cutout Bottom: 36.83,28.19 47.75,28.19 48.26,27.69 48.26,23.11 39.37,23.11 36.83,25.65
  cutout Bottom: 38.1,41.4 38.86,42.16 42.67,42.16 43.18,41.66 43.18,37.59 42.93,37.34 38.86,37.34 38.1,38.1
  cutout Bottom: 39.37,55.63 39.88,55.12 39.88,54.61 39.37,54.1 38.61,54.1 38.1,54.61 38.1,54.86 38.86,55.63
  cutout Bottom: 23.11,70.61 23.11,59.18 23.62,58.67 32.51,58.67 33.27,57.91 34.29,57.91 34.54,57.66 35.31,56.9 36.32,56.9 38.86,56.9 42.16,60.2 42.16,63.5 40.64,65.02 40.39,65.28 28.7,65.28 28.45,65.53 28.45,70.61 27.69,71.37 24.13,71.37 23.37,70.61
  cutout Bottom: 23.88,58.67 23.88,57.91 27.69,57.91 27.69,58.67
LED3
  Top 0.254: R5.2 50.23,48.26 48.45,50.04 45.97,50.04 45.62,50.39 IC2.10
LED4
  Top 0.254: JP3.2 29.21,69.85 34.04,65.02 36.51,65.02 R7.1 37.78,65.09 39.22,63.65 IC2.32
M1_1
  Top 0.254: D4.1 29.97,33.53 D5.2
  Top 1.016: IC1.3 36.58,36.07 35.81,35.31 31.67,35.31 D4.1 | JP1.2 22.35,45.72 23.88,44.2 23.88,38.1 28.45,33.53 29.97,33.53
  pour Top (no thermals): 31.75,33.78 30.99,34.54 29.72,34.54 28.96,33.78 28.96,31.24 29.46,30.73 31.24,30.73 31.75,31.24
M1_2  (via drill 0.35)
  Top 0.254: D3.2 D2.1
  Top 1.016: IC1.6 37.59,28.45 34.37,31.67 D3.2
  Bottom 1.016: JP1.1 22.86,46.23 22.86,37.85 27.43,33.27 34.54,33.27 v34.8,33.53
  other vias: 34.8,31.5 34.8,32.51
  pour Bottom: 32.77,33.78 33.27,34.29 35.31,34.29 35.81,33.78 35.81,31.5 35.05,30.73 33.53,30.73 33.27,30.73 32.77,31.24
  pour Top (no thermals): 35.81,33.78 35.31,34.29 33.27,34.29 32.77,33.78 32.77,31.24 33.27,30.73 35.05,30.73 35.81,31.5
M2_1
  Top 1.016: JP2.2 59.08,35.46 54.18,35.46 D8.1 49.86,36.07 IC1.14
  pour Top (no thermals): 53.59,34.04 53.34,34.29 51.05,34.29 50.8,34.04 50.8,31.75 51.56,30.99 52.83,30.99 53.59,31.75
M2_2
  Top 0.254: 55.63,31.67 D7.2
  Top 1.016: D6.1 59.77,33.61 71.12,44.96 71.12,46.99 69.85,48.26 JP2.1 | IC1.11 48.77,28.45 50.29,29.97 54.36,29.97 55.88,31.5 D7.2
  pour Top (no thermals): 57.4,33.78 56.64,34.54 55.37,34.54 54.61,33.78 54.61,31.24 55.12,30.73 56.9,30.73 57.4,31.24
MCLR  (via drill 0.35)
  Top 0.254: S1.2 S1.1 62.24,63.25 57.15,63.25 J2.1 R3.1 | v49.78,57.66 48.07,57.66 IC2.18
  Bottom 0.254: v49.78,57.66 51.56,57.66 J2.1
ME1_1  (via drill 0.35)
  Top 0.254: IC2.13 47.14,53.7 46.48,54.36 v46.48,54.61
  Bottom 0.254: v46.48,54.61 44.7,54.61 43.28,53.19 43.28,39.47 42.42,38.61 IC1.2
ME1_2  (via drill 0.35)
  Top 0.254: IC2.12 46.93,52.9 v46.48,53.34
  Bottom 0.254: v46.48,53.34 45.72,54.1 44.96,54.1 43.69,52.83 43.69,26.67 42.93,25.91 IC1.7
ME2_1  (via drill 0.35)
  Top 0.254: v45.72,49.28 44.82,50.18 IC2.9
  Bottom 0.254: v45.72,49.28 45.72,39.71 IC1.15
ME2_2  (via drill 0.35)
  Top 0.254: v44.45,49.53 44.02,49.96 IC2.8
  Bottom 0.254: IC1.10 44.2,28.54 44.2,49.28 v44.45,49.53
N$1
  Top 0.254: IC2.7 43.22,49.75 43.69,49.28 43.69,48.26 44.2,47.75 C8.1
N$2
  Top 0.254: LED2.1 R2.2
N$3
  Top 0.254: U1.7 40.39,14.22
  pour Top (no thermals): 40.13,12.7 39.88,12.95 38.1,12.95 37.85,13.21 37.85,14.73 38.1,14.99 40.64,14.99 40.89,14.73 40.89,13.21 40.39,12.7
N$4
  Top 0.254: LED1.1 R1.2
N$5
  Top 0.254: U2.7 35.82,13.46
  pour Top (no thermals): 35.56,12.7 35.31,12.95 33.27,12.95 33.02,13.21 33.02,14.73 33.27,14.99 36.07,14.99 36.32,14.73 36.32,13.21 35.81,12.7
N$6
  Top 0.508: T1.3 45.21,45.44 46.74,46.97 46.74,46.99 R5.1
N$7
  Top 0.254: R3.2 D1.1
N$8
  Top 0.508: LED3.2 45.72,43.94 46.23,44.45 R6.2
N$21
  Top 0.254: R7.2 35.12,66.99 32.51,69.6 32.51,77.72 LED4.2
N$22
  Top 0.508: T1.1 40.39,44.48 40.89,43.97 40.89,43.94 LED3.1
OSC1
  Top 0.254: C5.1 Y1.1 44.12,69.85 40.39,69.85 39.37,68.83 39.37,65.02 40.82,63.58 IC2.30
OSC2
  Top 0.254: C6.1 36.39,71.64 Y1.2 38.61,69.42 38.61,65.02 40.02,63.61 IC2.31
P2  (via drill 0.35)
  Top 0.254: IC2.2 39.22,50.29 38.71,49.78 v37.85,49.78
  Bottom 0.254: v37.85,49.78 31.75,49.78 28.34,53.19 26.06,53.19 JP3.13
P11  (via drill 0.35)
  Top 0.254: IC2.11 46.44,51.31 v48.26,51.31 | v44.45,55.88 42.42,53.85 v38.35,53.85
  Bottom 0.254: v48.26,51.31 48.26,55.37 46.99,56.64 45.97,56.64 45.21,55.88 v44.45,55.88 | JP3.14 27.94,53.85 v38.35,53.85
P24  (via drill 0.35)
  Top 0.254: v45.97,60.96 45.62,61.32 IC2.24
  Bottom 0.254: v45.97,60.96 45.97,61.72 41.66,66.04 30.23,66.04 27.69,68.58 25.91,68.58 JP3.1
P25  (via drill 0.35)
  Top 0.254: v44.96,60.96 44.82,61.1 IC2.25
  Bottom 0.254: v44.96,60.96 44.96,61.72 41.15,65.53 28.96,65.53 JP3.4
P33
  Top 0.254: IC2.33 34.61,62.51 31.08,66.04 25.91,66.04 JP3.3
P34
  Top 0.254: IC2.34 35.37,60.9 31.5,64.77 JP3.6
P35
  Top 0.254: IC2.35 35.41,60.1 32,63.5 25.91,63.5 JP3.5
P36
  Top 0.254: IC2.36 35.45,59.3 32.51,62.23 JP3.8
P37
  Top 0.254: IC2.37 35.48,58.5 33.02,60.96 25.91,60.96 JP3.7
P38
  Top 0.254: IC2.38 35.52,57.7 34.29,58.93 27.94,58.93 JP3.10
P41
  Top 0.254: IC2.41 35.48,55.3 34.55,54.37 34.55,54.36 34.3,54.1 32.51,54.1 28.45,58.17 26.16,58.17 JP3.9
P42
  Top 0.254: IC2.42 35.45,54.5 34.65,53.7 32.09,53.7 28.64,57.15 JP3.12
P43
  Top 0.254: JP3.11 25.91,55.88 25.91,54.36 26.97,53.29 35.01,53.29 35.41,53.7 IC2.43
PGC1
  Top 0.254: J2.5 48.11,64.37 48.11,61.98 48.11,61.83 48.11,60.98 IC2.22
PGD1
  Top 0.254: IC2.21 49.02,60.1 49.78,60.86 49.78,65.28 55.12,70.61 J2.4
PWM1  (via drill 0.35)
  Top 0.254: IC2.15 47.07,55.3 v46.48,55.88
  Bottom 0.254: v46.48,55.88 45.62,55.01 44.28,55.01 42.63,53.36 42.63,41.91 41.86,41.15 IC1.1
PWM2
  Top 0.254: IC2.3 40.02,50.18 36.58,46.74 36.58,38.35 37.59,37.34 41.15,37.34 42.93,35.56 42.93,27.27 IC1.9
RX_B  (via drill 0.35)
  Top 0.254: IC2.1 37.59,51.28 35.81,49.51 v35.81,40.39 | v41.4,27.43 41.4,25.91 45.21,22.1 50.55,22.1 54.1,18.54 J6.5
  Bottom 0.254: v35.81,40.39 36.83,39.37 36.83,30.73 38.1,29.46 40.64,29.46 41.4,28.7 v41.4,27.43
TX_B  (via drill 0.35)
  Top 0.254: IC2.44 35.62,52.9 35.05,52.32 v35.05,39.62 | v40.13,26.92 40.13,26.42 44.96,21.59 50.04,21.59 J6.4
  Bottom 0.254: v35.05,39.62 36.32,38.35 36.32,29.72 39.12,26.92 v40.13,26.92
VBAT  (via drill 0.35)
  Top 0.254: C3.2 35.82,8.82 U2.2 U2.3 | U1.3 U1.2 40.39,8.64 | C1.2 40.39,8.81 40.39,8.64 | 38.86,6.86 39.12,7.11 39.88,7.11 40.39,7.62 40.39,8.64
  Top 1.27: 38.86,6.86 J1.1 35.81,5.33 35.31,5.84 35.31,8.31 C3.2 | 39.12,7.11 39.95,7.95 C1.2
  Bottom 0.254: 39.03,23.11 IC1.8
  Bottom 1.27: J1.1 40.64,8.64 46.74,8.64 50.55,12.45 50.55,21.08
  other vias: 52.07,26.67 53.59,26.92 54.36,26.16 52.83,26.16 33.78,26.67 35.05,26.92 35.56,27.94
  pour Top (no thermals): 56.9,28.19 56.13,28.96 51.82,28.96 51.05,28.19 51.05,26.67 52.07,25.65 56.13,25.65 56.9,26.42
  pour Top (no thermals): 28.96,28.45 29.46,28.96 35.56,28.96 36.58,27.94 36.58,27.18 35.56,26.16 29.97,26.16 28.96,27.18
  pour Bottom (no thermals): 36.58,27.94 35.81,28.7 35.05,28.7 32.51,26.16 32.51,25.15 37.85,19.81 50.29,19.81 55.12,24.64 55.12,26.67 54.36,27.43 52.07,27.43 51.31,26.67 51.31,23.37 50.04,22.1 42.16,22.1 40.13,24.13 37.85,24.13 36.58,25.4

### Text on the board
tNames: * | * | D9 | +3V3 | +5V | GND | GND | U2 | U1